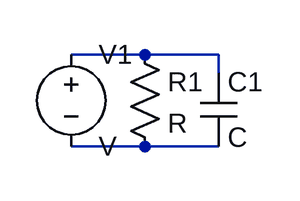
[diagram p0: schematic Draft1.asc]
Draft1.asc, the LTspice schematic file:
Version 4
SHEET 1 880 680
WIRE 96 96 32 96
WIRE 160 96 96 96
WIRE 160 112 160 96
WIRE 96 176 32 176
WIRE 160 176 96 176
SYMBOL res 80 80 R0
SYMATTR InstName R1
SYMBOL cap 144 112 R0
SYMATTR InstName C1
SYMBOL voltage 32 80 R0
SYMATTR InstName V1

The netlist it stands for:
* Draft1.asc
R1 N001 N002 R
C1 N001 N002 C
V1 N001 N002 V
.backanno
.end